# EAGLE schematic bipolar_inp (EAGLE 9.6.1)
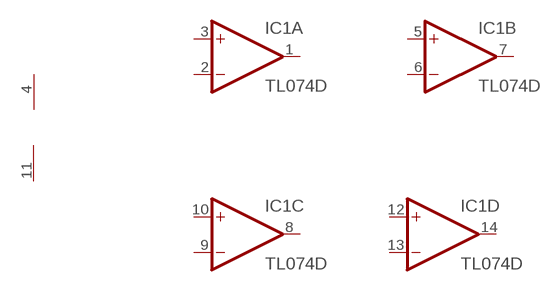
[diagram p0: schematic, sheet 1]

## Parts
IC1  TL074D  [SO14]
Unconnected: IC1.1(A:OUT) IC1.2(A:-IN) IC1.3(A:+IN) IC1.5(B:+IN) IC1.6(B:-IN) IC1.7(B:OUT) IC1.8(C:OUT) IC1.9(C:-IN) IC1.10(C:+IN) IC1.12(D:+IN) IC1.13(D:-IN) IC1.14(D:OUT)

## Power pins joined to a net without a drawn wire
V+: IC1.4(P:V+)
V-: IC1.11(P:V-)

## Library data of the parts
IC1 = linear:TL074: OP AMP

## Net classes
0 default: width 2.057 mm, drill 0.203 mm, clearance 0.203 mm